# Altium project preamp.PrjPCB
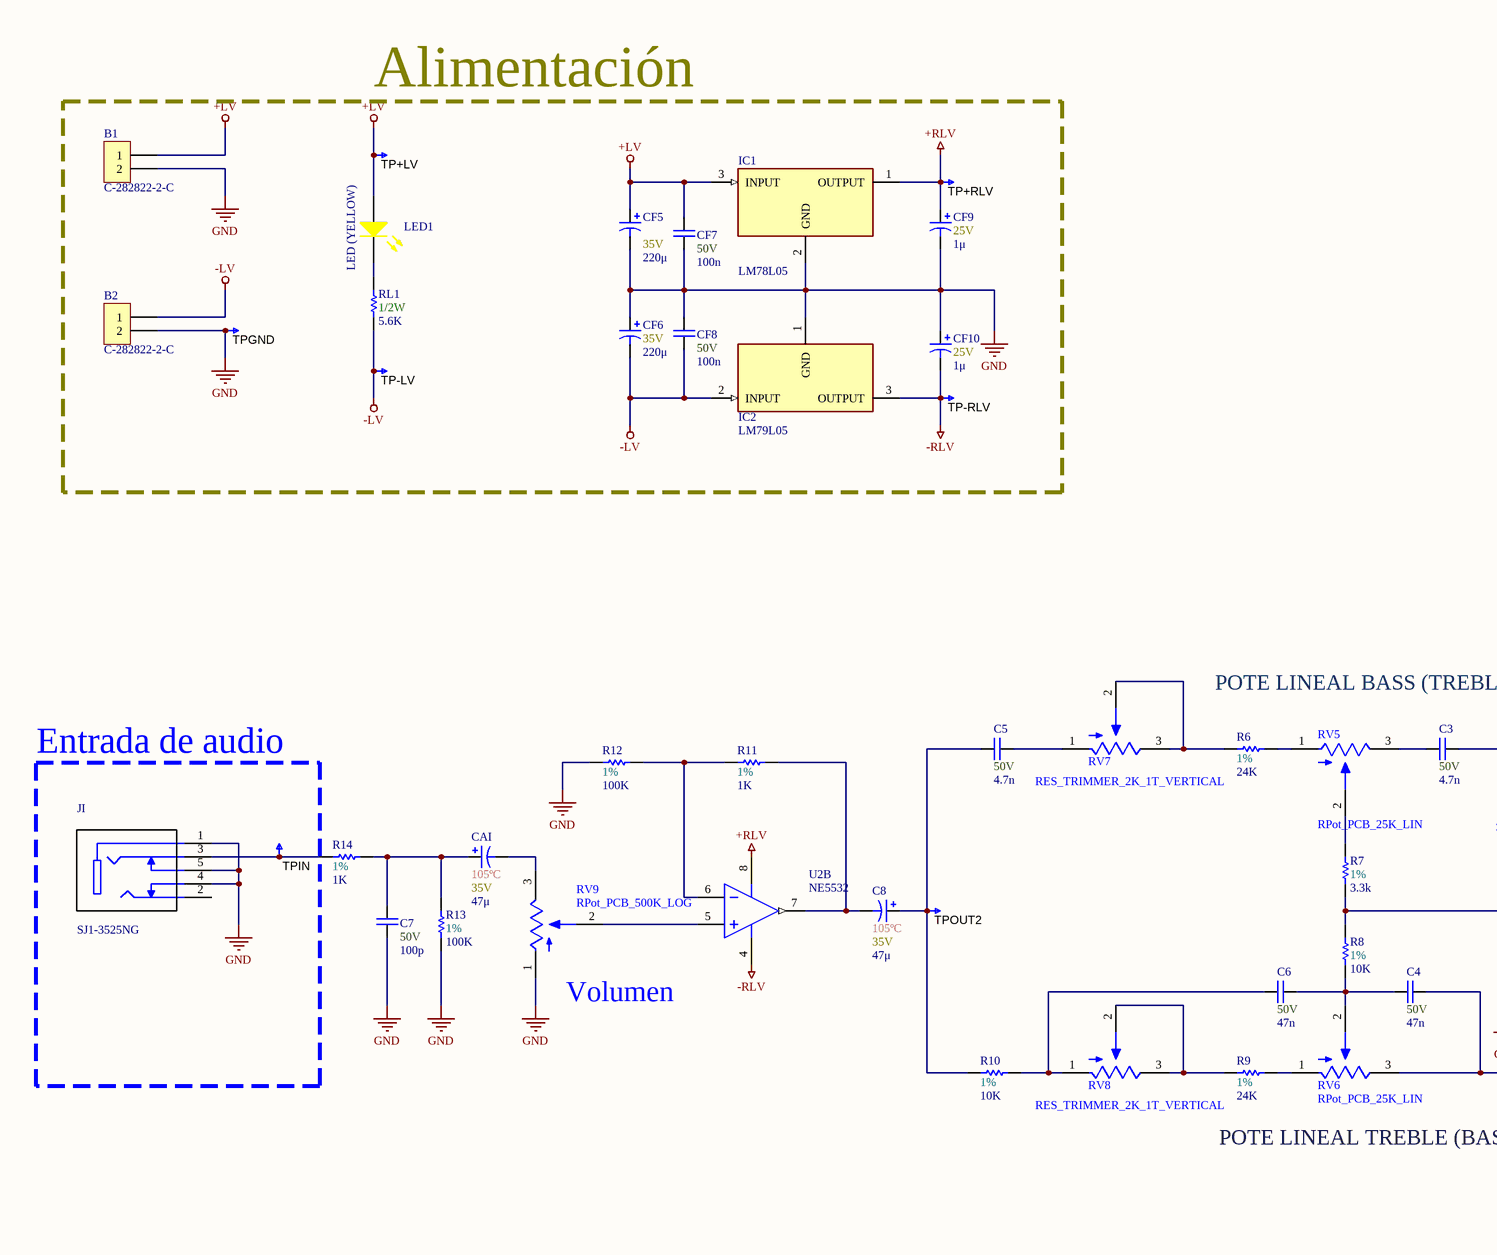
[diagram p0: preamp.SchDoc, left]
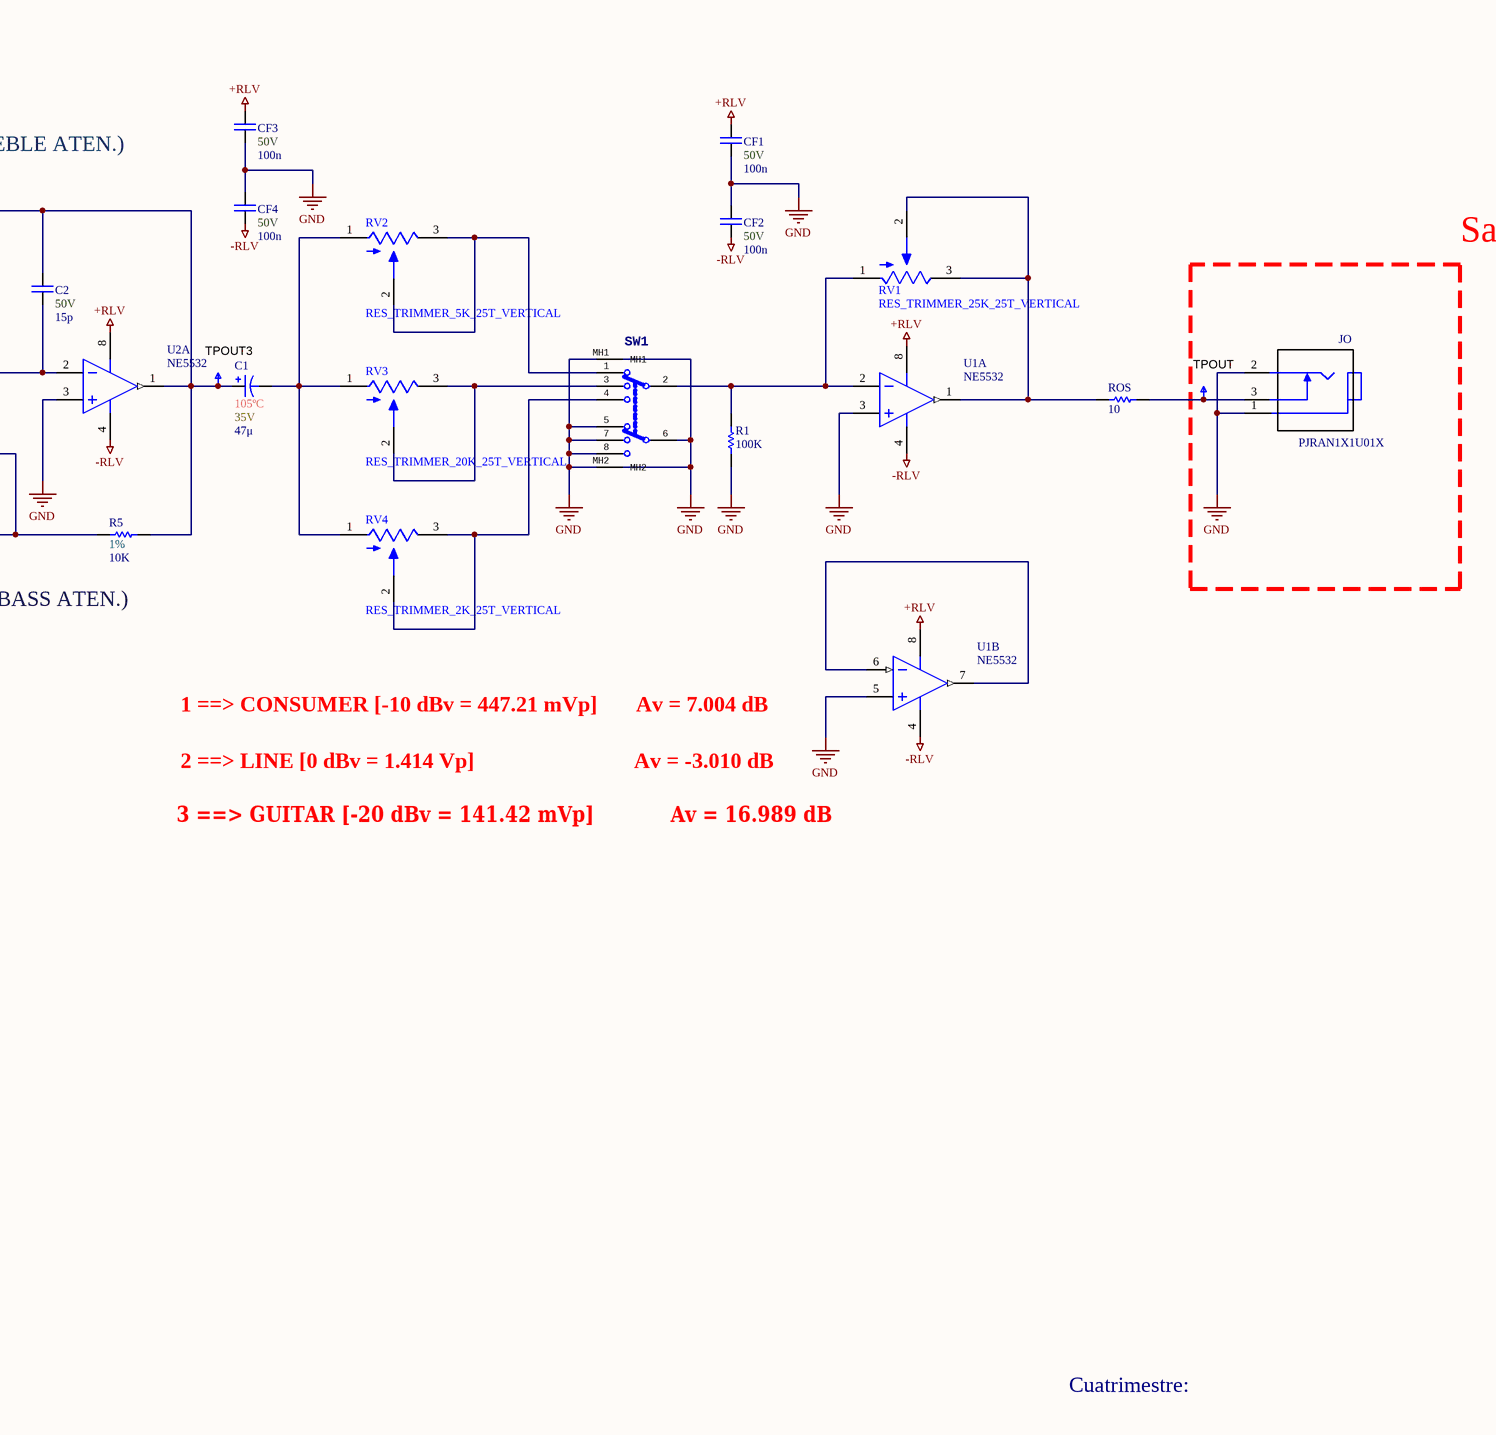
[diagram p1: preamp.SchDoc, right]
Cuatrimestre: 1º 2019; Grupo: Irusta - Luna - Niero - Romero; Organización: Facultad de ingeniería - UBA; Project Name: Proyecto de Circuitos electrónicos 2 - Control de tonos y vol.
1 sheet, 60 parts. Net scope: global (net labels, ports and power ports of the same name join across sheets).
Board file: preamp.PcbDoc

## Sheet preamp.SchDoc
size A2

### Parts
B1  C-282822-2-C  [TE-C-282822-2-C-PLUGGED]
B2  C-282822-2-C  [TE-C-282822-2-C-PLUGGED]
C1  value 47μ  Temperature: 105ºC  Voltage: 35V  [Al. Electrolytic 6.3mmx11.0mmx2.5mm-CLEAN]  (hidden comment: Al. Elect. 47u 35V 20% 105º)
C2  value 15p  Voltage: 50V  [Cer. pitch 5.08mm height 6.00mm]  (hidden comment: Cer. 15p 50V 10%)
C3  value 4.7n  Voltage: 50V  [Cer. pitch 5.5mm height 6.0mm]  (hidden comment: Cer. 4.7n 50V 10%)
C4  value 47n  Voltage: 50V  [Cer. pitch 5.5mm height 6.0mm]  (hidden comment: Cer. 47n 50V 10%)
C5  value 4.7n  Voltage: 50V  [Cer. pitch 5.5mm height 6.0mm]  (hidden comment: Cer. 4.7n 50V 10%)
C6  value 47n  Voltage: 50V  [Cer. pitch 5.5mm height 6.0mm]  (hidden comment: Cer. 47n 50V 10%)
C7  value 100p  Voltage: 50V  [Cer. pitch 5.08mm height 6.00mm]  (hidden comment: Cer. 100p 50V 10%)
C8  value 47μ  Temperature: 105ºC  Voltage: 35V  [Al. Electrolytic 6.3mmx11.0mmx2.5mm-CLEAN]  (hidden comment: Al. Elect. 47u 35V 20% 105º)
CAI  value 47μ  Temperature: 105ºC  Voltage: 35V  [Al. Electrolytic 6.3mmx11.0mmx2.5mm-CLEAN]  (hidden comment: Al. Elect. 47u 35V 20% 105º)
CF1  value 100n  Voltage: 50V  [Cer. pitch 5.0mm height 5.5mm]  (hidden comment: Cer. 100n 50V 10%)
CF2  value 100n  Voltage: 50V  [Cer. pitch 5.0mm height 5.5mm]  (hidden comment: Cer. 100n 50V 10%)
CF3  value 100n  Voltage: 50V  [Cer. pitch 5.0mm height 5.5mm]  (hidden comment: Cer. 100n 50V 10%)
CF4  value 100n  Voltage: 50V  [Cer. pitch 5.0mm height 5.5mm]  (hidden comment: Cer. 100n 50V 10%)
CF5  value 220μ  Voltage: 35V  [Al. Electrolytic 8.0mmx13.0mmx3.5mm-CLEAN]  (hidden comment: Al. Elect. 220u 35V 20% 105º)
CF6  value 220μ  Voltage: 35V  [Al. Electrolytic 8.0mmx13.0mmx3.5mm-CLEAN]  (hidden comment: Al. Elect. 220u 35V 20% 105º)
CF7  value 100n  Voltage: 50V  [Cer. pitch 5.0mm height 5.5mm]  (hidden comment: Cer. 100n 50V 10%)
CF8  value 100n  Voltage: 50V  [Cer. pitch 5.0mm height 5.5mm]  (hidden comment: Cer. 100n 50V 10%)
CF9  value 1μ  Voltage: 25V  [Tantalum Electrolytic 4.5mmx8.0mmx0.254mm-CLEAN]  (hidden comment: Tant. Elect. 1u 25V 10%)
CF10  value 1μ  Voltage: 25V  [Tantalum Electrolytic 4.5mmx8.0mmx0.254mm-CLEAN]  (hidden comment: Tant. Elect. 1u 25V 10%)
IC1  LM78L05  [TO-92-1]
IC2  LM79L05  [TO-92-1]
JI  SJ1-3525NG  [*CUI_SJ1-3525NG]
JO  PJRAN1X1U01X  [*SWITCHCRAFT_PJRAN1X1U01X]
LED1  LED (YELLOW)  [LED_5MM_YELLOW]
R1  value 100K  [AXIAL-0.4-E24-0_25W-100k]  (hidden comment: Resistor 100K 1/4W 5%)
R5  value 10K  Tolerance: 1%  [AXIAL-0.4-E24-0_25W-10k-1%]  (hidden comment: Resistor 10K 1/4W 1%)
R6  value 24K  Tolerance: 1%  [AXIAL-0.4-E24-0_25W-24k-1%]  (hidden comment: Resistor 24K 1/4W 1%)
R7  value 3.3k  Tolerance: 1%  [AXIAL-0.4-E24-0_25W-3.3k-1%]  (hidden comment: Resistor 3.3k 1/4W 1%)
R8  value 10K  Tolerance: 1%  [AXIAL-0.4-E24-0_25W-10k-1%]  (hidden comment: Resistor 10K 1/4W 1%)
R9  value 24K  Tolerance: 1%  [AXIAL-0.4-E24-0_25W-24k-1%]  (hidden comment: Resistor 24K 1/4W 1%)
R10  value 10K  Tolerance: 1%  [AXIAL-0.4-E24-0_25W-10k-1%]  (hidden comment: Resistor 10K 1/4W 1%)
R11  value 1K  Tolerance: 1%  [AXIAL-0.4-E24-0_25W-1k-1%]  (hidden comment: Resistor 1K 1/4W 1%)
R12  value 100K  Tolerance: 1%  [AXIAL-0.4-E24-0_25W-100k-1%]  (hidden comment: Resistor 100K 1/4W 1%)
R13  value 100K  Tolerance: 1%  [AXIAL-0.4-E24-0_25W-100k-1%]  (hidden comment: Resistor 100K 1/4W 1%)
R14  value 1K  Tolerance: 1%  [AXIAL-0.4-E24-0_25W-1k-1%]  (hidden comment: Resistor 1K 1/4W 1%)
RL1  value 5.6K  Power: 1/2W  [AXIAL-0.5-E24-0_5W-5.6K]  (hidden comment: Resistor 5.6K 1/2W 5%)
ROS  value 10  [AXIAL-0.4-E24-0_25W-10]  (hidden comment: Resistor 10 1/4W 5%)
RV1  RES_TRIMMER_25K_25T_VERTICAL  [POT_3296W]
RV2  RES_TRIMMER_5K_25T_VERTICAL  [POT_3296W]
RV3  RES_TRIMMER_20K_25T_VERTICAL  [POT_3296W]
RV4  RES_TRIMMER_2K_25T_VERTICAL  [POT_3296W]
RV5  RPot_PCB_25K_LIN  [POTE16mm]
RV6  RPot_PCB_25K_LIN  [POTE16mm]
RV7  RES_TRIMMER_2K_1T_VERTICAL  [POT_3386W]
RV8  RES_TRIMMER_2K_1T_VERTICAL  [POT_3386W]
RV9  RPot_PCB_500K_LOG  [POTE16mm]
SW1  SWITCH SLIDE DP3T 200MA 30V  [E-SWITCH_EG2315]  (value not drawn)
TP+LV  TESTPOINT_THT  [TP-THT-MULTI]  (value not drawn)
TP+RLV  TESTPOINT_THT  [TP-THT-MULTI]  (value not drawn)
TP-LV  TESTPOINT_THT  [TP-THT-MULTI]  (value not drawn)
TP-RLV  TESTPOINT_THT  [TP-THT-MULTI]  (value not drawn)
TPGND  TESTPOINT_THT  [TP-THT-MULTI]  (value not drawn)
TPIN  TESTPOINT_THT  [TP-THT-MULTI]  (value not drawn)
TPOUT  TESTPOINT_THT  [TP-THT-MULTI]  (value not drawn)
TPOUT2  TESTPOINT_THT  [TP-THT-MULTI]  (value not drawn)
TPOUT3  TESTPOINT_THT  [TP-THT-MULTI]  (value not drawn)
U1  NE5532  [DIP8 - W SOCKET]  (parts A,B of 2)
U2  NE5532  [DIP8 - W SOCKET]  (parts A,B of 2)

### Blocks framed on the sheet
Alimentación: B1 B2 CF5-CF10 IC1 IC2 LED1 RL1 TP+LV TP+RLV TP-LV TP-RLV TPGND
Entrada de audio: JI TPIN
Salida de audio (1Vp): JO TPOUT

### Nets
+LV: B1.1 CF5.1 CF7.2 IC1.3(INPUT) LED1.A TP+LV.1
+RLV: CF1.2 CF3.2 CF9.1 IC1.1(OUTPUT) TP+RLV.1 U1.8(V+) U2.8(V+)
-LV: B2.1 CF6.2 CF8.1 IC2.2(INPUT) RL1.1 TP-LV.1
-RLV: CF2.1 CF4.1 CF10.2 IC2.3(OUTPUT) TP-RLV.1 U1.4(V-) U2.4(V-)
GND: B1.2 B2.2 C7.2 CF1.1 CF2.2 CF3.1 CF4.2 CF5.2 CF6.1 CF7.1 CF8.2 CF9.2 CF10.1 IC1.2(GND) IC2.1(GND) JI.1 JI.4 JI.5 JO.1 JO.2 R1.1 R12.1 R13.1 RV9.1(A) SW1.5 SW1.6(2_COM) SW1.7 SW1.8 SW1.MH1 SW1.MH2 TPGND.1 U1.3(INA+) U1.5(INB+) U2.3(INA+)
NetC1_1: C1.1 C2.2 C3.2 R5.2 TPOUT3.1 U2.1(OUTA)
NetC1_2: C1.2 RV2.1(A) RV3.1(A) RV4.1(A)
NetC2_1: C2.1 R7.2 R8.2 U2.2(INA-)
NetC3_1: C3.1 RV5.3(C)
NetC4_1: C4.1 C6.2 R8.1 RV6.2(B)
NetC4_2: C4.2 R5.1 RV6.3(C)
NetC5_1: C5.1 C8.1 R10.1 TPOUT2.1
NetC5_2: C5.2 RV7.1(A)
NetC6_1: C6.1 R10.2 RV8.1(A)
NetC7_1: C7.1 CAI.1 R13.2 R14.2
NetC8_2: C8.2 R11.1 U2.7(OUTB)
NetCAI_2: CAI.2 RV9.3(C)
NetJI_3: JI.3 R14.1 TPIN.1
NetJO_3: JO.3 ROS.2 TPOUT.1
NetLED1_K: LED1.K RL1.2
NetR1_2: R1.2 RV1.1(A) SW1.2(1_COM) U1.2(INA-)
NetR6_1: R6.1 RV5.1(A)
NetR6_2: R6.2 RV7.2(B) RV7.3(C)
NetR7_1: R7.1 RV5.2(B)
NetR9_1: R9.1 RV6.1(A)
NetR9_2: R9.2 RV8.2(B) RV8.3(C)
NetR11_2: R11.2 R12.2 U2.6(INB-)
NetROS_1: ROS.1 RV1.2(B) RV1.3(C) U1.1(OUTA)
NetRV2_2: RV2.2(B) RV2.3(C) SW1.1
NetRV3_2: RV3.2(B) RV3.3(C) SW1.3
NetRV4_2: RV4.2(B) RV4.3(C) SW1.4
NetRV9_2: RV9.2(B) U2.5(INB+)
NetU1_6: U1.6(INB-) U1.7(OUTB)

Not connected (* = marked no-connect by the designer): JI 2

### Notes on the sheet
- POTE LINEAL BASS (TREBLE ATEN.)
- (near RV9) Volumen
- POTE LINEAL TREBLE (BASS ATEN.)
- 1 ==> CONSUMER [-10 dBv = 447.21 mVp]       Av = 7.004 dB
- (near U1) 2 ==> LINE [0 dBv = 1.414 Vp]                             Av = -3.010 dB
- 3 ==> GUITAR [-20 dBv = 141.42 mV‬p]            Av = 16.989 dB
- Cuatrimestre:

### Library data of the parts
B1 B2 = C-282822-2-C: TERMI-BLOK HEADER,ASSY90 2P - serie 282822 - 5.00mm; Manufacturer: TE Connectivity; ComponentLink1 Description: Manufacturer; ComponentLink2 Description: Datasheet; NoPins: 02; Created Date: 6 MArch 2017; partNo: C-282822-2-C; ComponentLink1URL: http://www.te.com/usa-en/home.html; ComponentLink2URL: http://www.te.com/usa-en/product-282822-2.html
C1 C8 CAI = Al. Elect. 47u 35V 20% 105º: Aluminum Electrolytic Capacitor 47μF 35V 20% 105º; Application: Medium and high voltage type range from 160V-450V used as primary side input filter in power supply, which can be used in general switching power supply, PC power supply and industrial computer power supply,server power supply, AC-DC converter, motor drive circuit DC storage filter, digital audio, digital TV, communication base station, DC-AC inverter, inverter power supply and converters etc; Characteristics: Aluminum Electrolytic Capacitor; Tolerance: 20%; Price: *; Supplier: *; Power: *
C2 = Cer. 15p 50V 10%: Ceramic Capacitor 15pF 50V 10%; Application: Medium and high voltage type range from 160V-450V used as primary side input filter in power supply, which can be used in general switching power supply, PC power supply and industrial computer power supply,server power supply, AC-DC converter, motor drive circuit DC storage filter, digital audio, digital TV, communication base station, DC-AC inverter, inverter power supply and converters etc; Characteristics: Ceramic Capacitor; Tolerance: 10%; Price: *; Power: *; Supplier: *
C3 C5 = Cer. 4.7n 50V 10%: Ceramic Capacitor 4.7nF 50V 10%; Application: Medium and high voltage type range from 160V-450V used as primary side input filter in power supply, which can be used in general switching power supply, PC power supply and industrial computer power supply,server power supply, AC-DC converter, motor drive circuit DC storage filter, digital audio, digital TV, communication base station, DC-AC inverter, inverter power supply and converters etc; Characteristics: Ceramic Capacitor; Tolerance: 10%; Power: *; Supplier: *; Price: *
C4 C6 = Cer. 47n 50V 10%: Ceramic Capacitor 47nF 50V 10%; Application: Medium and high voltage type range from 160V-450V used as primary side input filter in power supply, which can be used in general switching power supply, PC power supply and industrial computer power supply,server power supply, AC-DC converter, motor drive circuit DC storage filter, digital audio, digital TV, communication base station, DC-AC inverter, inverter power supply and converters etc; Characteristics: Ceramic Capacitor; Tolerance: 10%; Power: *; Supplier: *; Price: *
C7 = Cer. 100p 50V 10%: Ceramic Capacitor 100pF 50V 10%; Application: Medium and high voltage type range from 160V-450V used as primary side input filter in power supply, which can be used in general switching power supply, PC power supply and industrial computer power supply,server power supply, AC-DC converter, motor drive circuit DC storage filter, digital audio, digital TV, communication base station, DC-AC inverter, inverter power supply and converters etc; Characteristics: Ceramic Capacitor; Tolerance: 10%; Price: *; Power: *; Supplier: *
CF1-CF4 CF7 CF8 = Cer. 100n 50V 10%: Ceramic Capacitor 100nF 50V 10%; Application: Medium and high voltage type range from 160V-450V used as primary side input filter in power supply, which can be used in general switching power supply, PC power supply and industrial computer power supply,server power supply, AC-DC converter, motor drive circuit DC storage filter, digital audio, digital TV, communication base station, DC-AC inverter, inverter power supply and converters etc; Characteristics: Ceramic Capacitor; Tolerance: 10%; Supplier: *; Price: *; Power: *
CF5 CF6 = Al. Elect. 220u 35V 20% 105º: Aluminum Electrolytic Capacitor 220μF 35V 20% 105º; Application: Medium and high voltage type range from 160V-450V used as primary side input filter in power supply, which can be used in general switching power supply, PC power supply and industrial computer power supply,server power supply, AC-DC converter, motor drive circuit DC storage filter, digital audio, digital TV, communication base station, DC-AC inverter, inverter power supply and converters etc; Characteristics: Aluminum Electrolytic Capacitor; Tolerance: 20%; Price: *; Supplier: *; Power: *; Temperature: 105ºC
CF9 CF10 = Tant. Elect. 1u 25V 10%: Tantalum Electrolytic Capacitor 1μF 25V 10%; Application: Medium and high voltage type range from 160V-450V used as primary side input filter in power supply, which can be used in general switching power supply, PC power supply and industrial computer power supply,server power supply, AC-DC converter, motor drive circuit DC storage filter, digital audio, digital TV, communication base station, DC-AC inverter, inverter power supply and converters etc; Characteristics: Tantalum Electrolytic Capacitor; Tolerance: 10%; Temperature: *; Price: *; Supplier: *; Power: *
IC1 = LM78L05: 5V fixed regulator - 100mA; Manufacturer_Part_Number: LM7805; Height: 4.7mm; Power: *; Price: *; Supplier: *
IC2 = LM79L05: -5V fixed regulator - 100mA; Manufacturer_Part_Number: LM7805; Height: 4.7mm; Power: *; Price: *; Supplier: *
JO = PJRAN1X1U01X: Conn Phono Jack F 3 POS Solder RA Thru-Hole 3 Terminal 1 Port; MF: Switchcraft; Package: None; Price: None; MP: PJRAN1X1U01X; Availability: Unavailable; SnapEDA_Link: https://www.snapeda.com/parts/PJRAN1X1U01X/Switchcraft%20Inc./view-part/?ref=snap; Value: *
LED1 = LED (YELLOW): Typical LED (YELLOW); Publisher: Altium Limited
R1 = Resistor 100K 1/4W 5%: Resistor 100KΩ 1/4W 5%; Power: 1/4W; Tolerance: 5%; Price: *; Type: (TH) Metal film; Supplier: *
R5 R8 R10 = Resistor 10K 1/4W 1%: Resistor 10KΩ 1/4W 1%; Power: 1/4W; Price: *; Supplier: *; Type: (TH) Metal film
R6 R9 = Resistor 24K 1/4W 1%: Resistor 24KΩ 1/4W 1%; Price: *; Supplier: *; Type: (TH) Metal film; Power: 1/4W
R7 = Resistor 3.3k 1/4W 1%: Resistor 3.3kΩ 1/4W 1%; Power: 1/4W; Price: *; Supplier: *; Type: (TH) Metal film
R11 R14 = Resistor 1K 1/4W 1%: Resistor 1KΩ 1/4W 1%; Power: 1/4W; Type: (TH) Metal film; Supplier: *; Price: *
R12 R13 = Resistor 100K 1/4W 1%: Resistor 100KΩ 1/4W 1%; Power: 1/4W; Price: *; Type: (TH) Metal film; Supplier: *
RL1 = Resistor 5.6K 1/2W 5%: Resistor 5.6KΩ 1/2W 5%; Tolerance: 5%; Price: *; Type: (TH) Metal film; Supplier: *
ROS = Resistor 10 1/4W 5%: Resistor 10Ω 1/4W 5%; Power: 1/4W; Tolerance: 5%; Price: *; Supplier: *; Type: (TH) Metal film
RV1 = RES_TRIMMER_25K_25T_VERTICAL: Trimmer Vertical 25K 500mW 25-turn; Tolerance: ±10%; Ratings: 1/2W; ±100ppm/°C; Material: Cermet; Supplier: *; Power: 25k; Price: *; value: *
RV2 = RES_TRIMMER_5K_25T_VERTICAL: Trimmer Vertical 5K 500mW 25-turn; Tolerance: ±10%; Ratings: 1/2W; ±100ppm/°C; Material: Cermet; Supplier: *; Power: *; Price: *; value: 5k
RV3 = RES_TRIMMER_20K_25T_VERTICAL: Trimmer Vertical 20K 500mW 25-turn; Tolerance: ±10%; Ratings: 1/2W; ±100ppm/°C; Material: Cermet; Supplier: *; Power: *; Price: *; value: 20k
RV4 = RES_TRIMMER_2K_25T_VERTICAL: Trimmer Vertical 2K 500mW 25-turn; Tolerance: ±10%; Ratings: 1/2W; ±100ppm/°C; Material: Cermet; Supplier: *; Power: *; Price: *; value: 2k
RV5 RV6 = RPot_PCB_25K_LIN: 25K PCB LIN Potentiometer; Supplier: *; Price: *; Power: *; Value: 25k
RV7 RV8 = RES_TRIMMER_2K_1T_VERTICAL: Trimmer Vertical 2K 500mW 1-turn; Tolerance: ±10%; Ratings: 1/2W; ±100ppm/°C; Material: Cermet; Supplier: *; Power: *; Price: *; value: 2k
RV9 = RPot_PCB_500K_LOG: 500K PCB LOG Potentiometer; Supplier: *; Price: *; Power: *; Value: 500k
SW1 = E-SWITCH_EG2315E: EG Series DP3T On-On-On 0.2 A Right Angle Through Hole Slide Switch; MPN: EG2315; GateName_1: G$0; SymbolName_1: E-SWITCH_EG2315_0_0; contact_resistance: 20mΩ; prefix: SW; mfg_package_ident_rev: 0; temperature_range_high: +70°C; temperature_range_low: -20°C; device_class_L1: Electromechanical; verification_version: 0.0.0.1; contact_current_rating: 0.2A; lead_free: yes; device_class_L2: Switches; device_class_L3: Slide Switches; centroid_not_specified: No; DeviceName: E-SWITCH_EG2315_0_0; LibraryName: Upverter Library; DeviceSetName: E-SWITCH_EG2315; package: PTH_SW_12MM6_6MM8; mouser_description: Slide Switches SIDE OP PC MNT DP3T; mouser_part_number: 612-EG2315; mfg_package_ident_date: 0; throw_configuration: DP3T; digikey_description: SWITCH SLIDE DP3T 200MA 30V; digikey_part_number: EG1913-ND; datasheet: https://www.e-switch.com/system/asset/product_line/data_sheet/119/EG.pdf; footprint_url: http://spec_sheets.e-switch.com/specs/P040240.pdf; height: 5.1mm; mfg_package_ident: EG2315; voltage_rating_DC: 30V; rohs: yes; MF: E-Switch
TP+LV TP+RLV TP-LV TP-RLV TPGND TPIN TPOUT TPOUT2 TPOUT3 = TESTPOINT_THT: Test Point PCB mount Multi-purpose Black; Manufacturer 1: Keystone Electronics; Manufacturer Part Number 1: 5014; PBL Part Number: 3100-xxx; Description 1: TEST POINT PC MULTI PURPOSE YEL; Supplier 1: Digi-Key; Supplier Part Number 1: 5014K-ND; Mounting Type: 0.063" (1.600mm) Hole Diameter; Material: Base, Nylon 46, UL 94V-0
U1 U2 = NE5532: Dual Low-Noise Operational Amplifiers; Manufacturer: Texas Instruments; PowerWise: N; PackageReference: N08E; PackageDescription: MDIP, .365 x .250 x .130in, 8 Lead, .100in Pitch; PartNumber: NE5532; RoHS: N; PinCount: 8; CompType: Amplifiers; Code_JEDEC: MS-001-BA; ComponentLink1Description: Manufacturer URL; ComponentLink1URL: http://www.ti.com/; ComponentLink2Description: NE5532 Datasheet; ComponentLink2URL: http://www.ti.com/lit/gpn/ne5532; ComponentLink3Description: NE5532 Web Page; ComponentLink3URL: http://www.ti.com/product/NE5532?keyMatch=NE5532&tisearch=Search-EN-Everything; ComponentLink4Description: NE5532 Package Page; ComponentLink4URL: http://www.ti.com/product/NE5532/pinout-quality; Supplier: *; Price: *; Power: *
JI = SJ1-3525NG: Value: *; Supplier: *; Power: *; Price: *